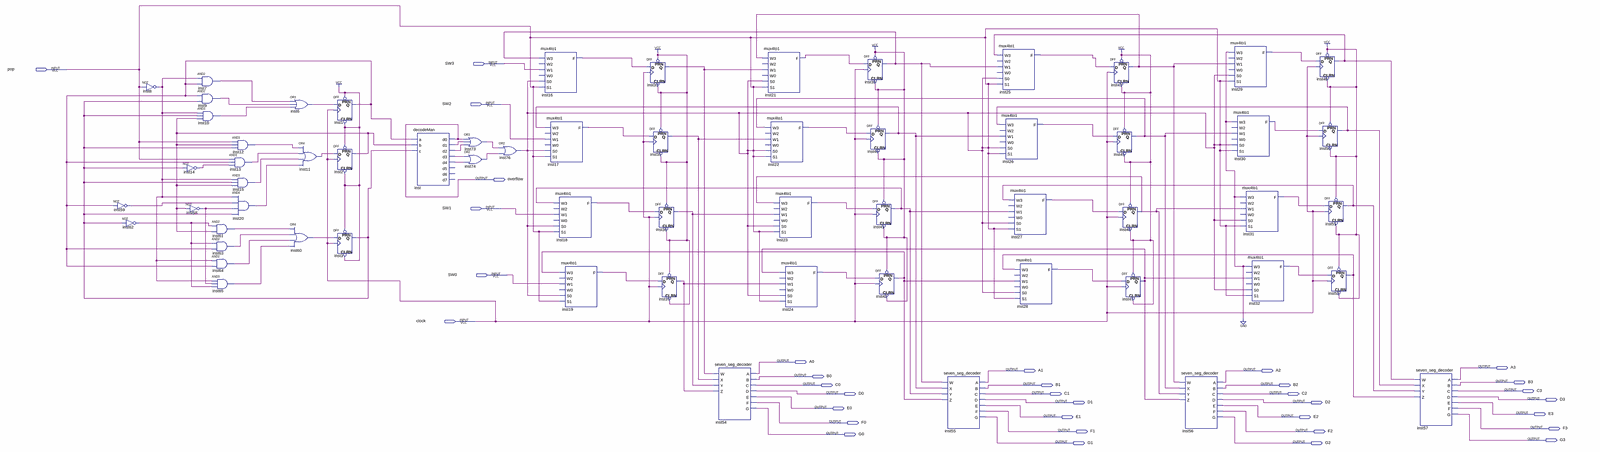
[diagram p0: schematic sheet, whole]
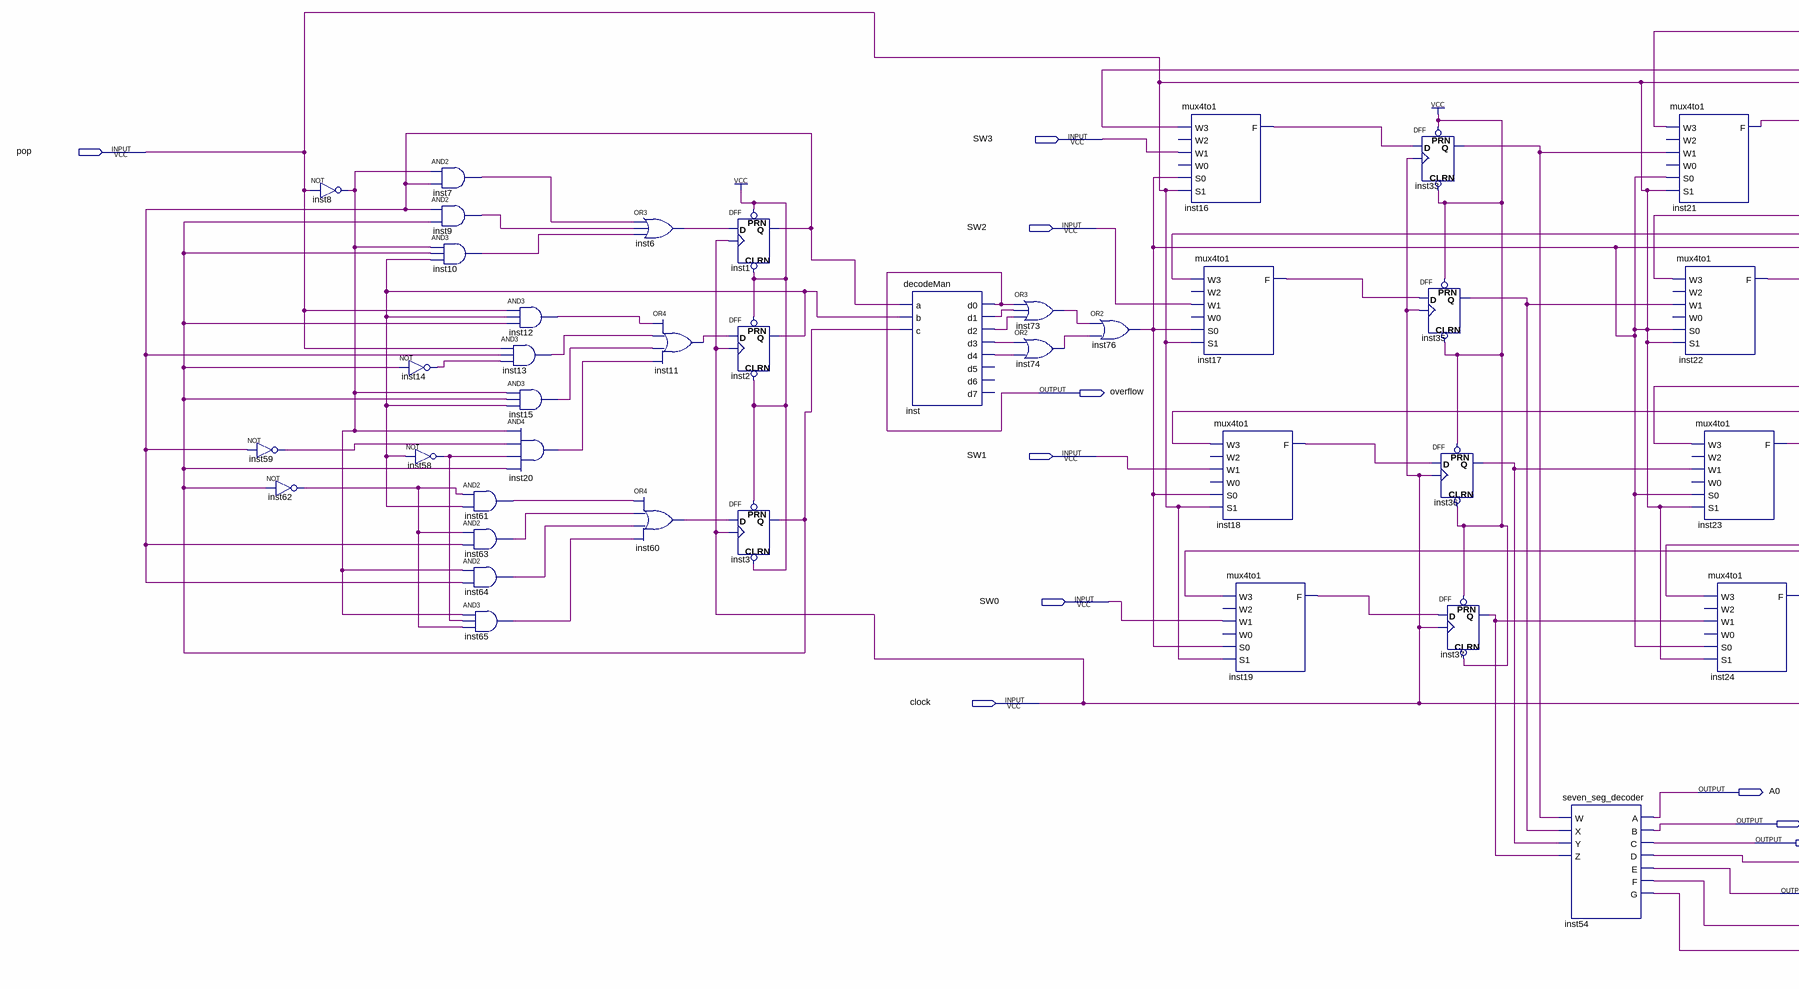
[diagram p1: schematic sheet, left part]
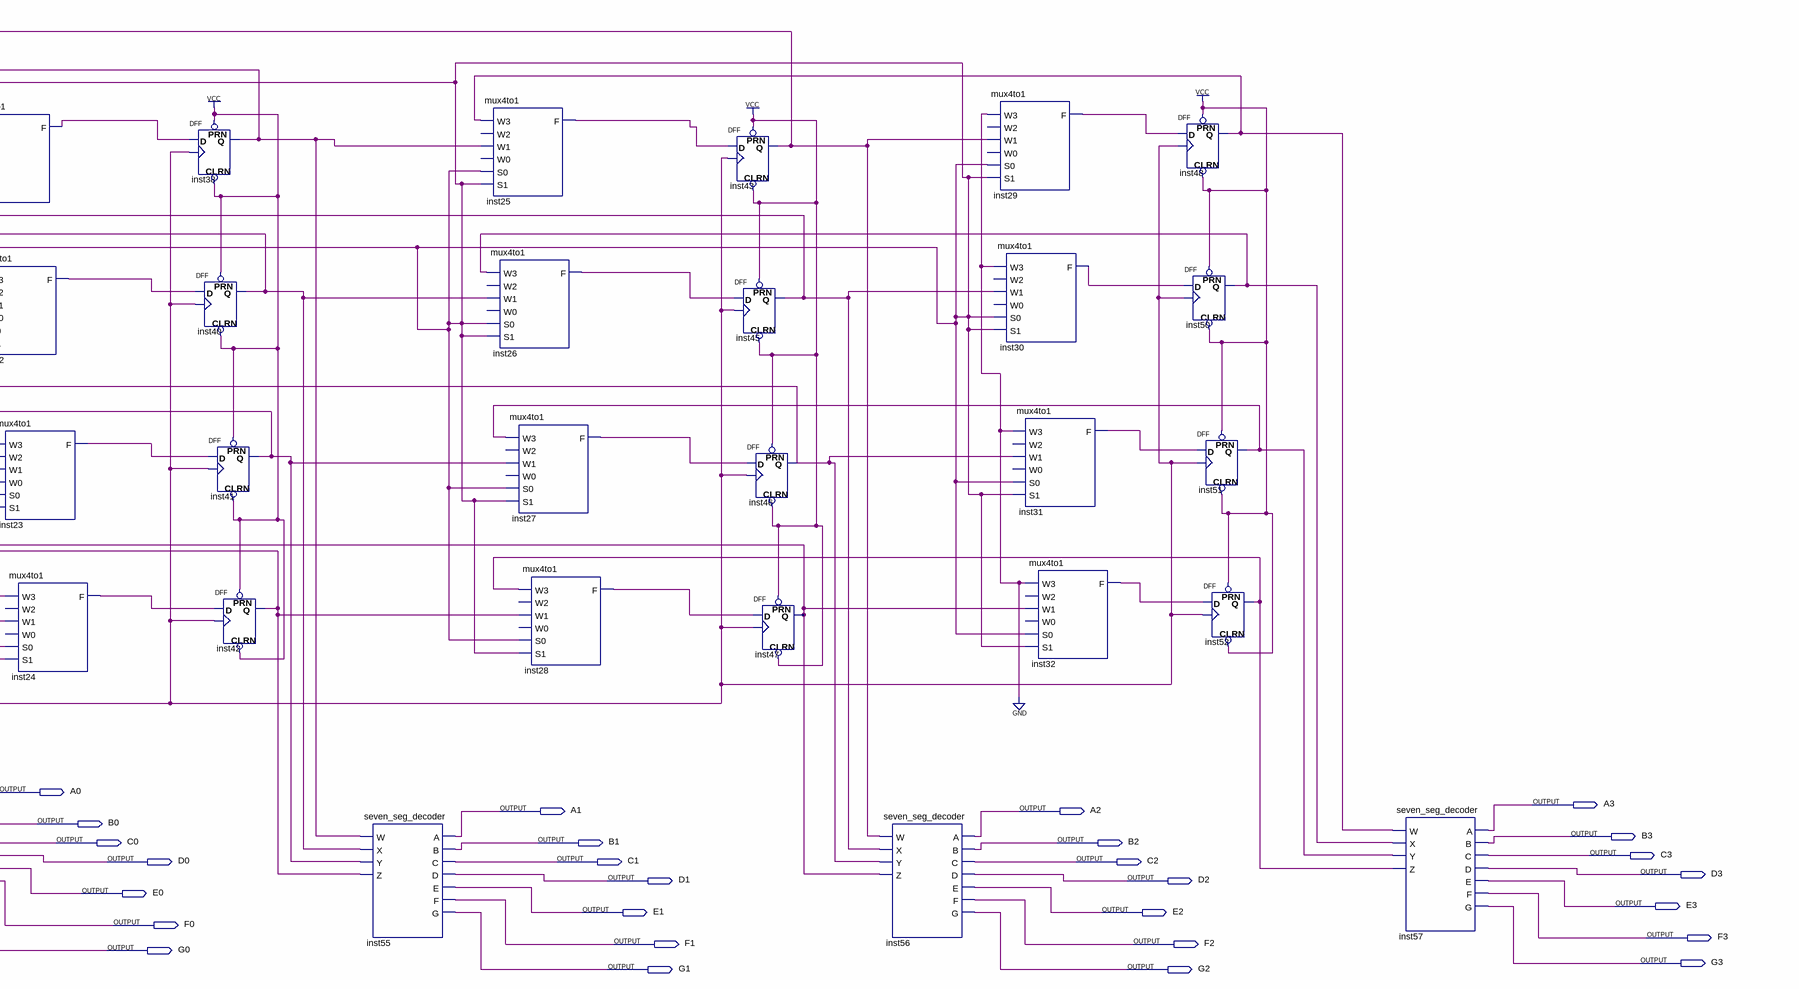
[diagram p2: schematic sheet, right part]
// Quartus schematic AddSubtract.bdf as structural Verilog: 62 symbols, 35 pins
module AddSubtract (
  input  SW3,
  input  pop,
  input  SW2,
  input  SW1,
  input  SW0,
  input  clock,
  output overflow,
  output A0,
  output A3,
  output A1,
  output A2,
  output B0,
  output B3,
  output C0,
  output B1,
  output B2,
  output C3,
  output D0,
  output C1,
  output C2,
  output D3,
  output D1,
  output D2,
  output E0,
  output E3,
  output E1,
  output E2,
  output F0,
  output F3,
  output F1,
  output F2,
  output G0,
  output G3,
  output G1,
  output G2
);

  wire inst1_q, inst2_q, inst3_q, inst6_out, inst7_out, inst8_out, inst9_out, inst10_out, inst11_out,
       inst12_out, inst13_out, inst14_out, inst15_out, inst16_f, inst17_f, inst18_f, inst19_f, inst20_out,
       inst21_f, inst22_f, inst23_f, inst24_f, inst25_f, inst26_f, inst27_f, inst28_f, inst29_f, inst30_f,
       inst31_f, inst32_f, inst33_q, inst35_q, inst36_q, inst37_q, inst38_q, inst40_q, inst41_q, inst42_q,
       inst43_q, inst45_q, inst46_q, inst47_q, inst48_q, inst50_q, inst51_q, inst52_q, inst58_out,
       inst59_out, inst60_out, inst61_out, inst62_out, inst63_out, inst64_out, inst65_out, inst73_out,
       inst74_out, inst_d1, inst_d2, inst_d3, inst_d4;

  not inst59 (inst59_out, inst1_q);
  not inst62 (inst62_out, inst3_q);
  not inst8 (inst8_out, pop);
  not inst14 (inst14_out, inst3_q);
  not inst58 (inst58_out, inst2_q);
  and inst7 (inst7_out, inst8_out, inst1_q);
  and inst9 (inst9_out, inst1_q, inst3_q);
  and inst10 (inst10_out, inst8_out, inst3_q, inst2_q);
  and inst61 (inst61_out, inst62_out, inst2_q);
  and inst63 (inst63_out, inst62_out, inst1_q);
  and inst64 (inst64_out, inst8_out, inst1_q);
  and inst65 (inst65_out, inst8_out, inst58_out, inst62_out);
  and inst12 (inst12_out, pop, inst2_q, inst3_q);
  and inst13 (inst13_out, pop, inst1_q, inst14_out);
  and inst15 (inst15_out, inst8_out, inst3_q, inst2_q);
  and inst20 (inst20_out, inst8_out, inst59_out, inst58_out, inst3_q);
  or inst6 (inst6_out, inst7_out, inst9_out, inst10_out);
  or inst11 (inst11_out, inst12_out, inst13_out, inst15_out, inst20_out);
  or inst60 (inst60_out, inst61_out, inst63_out, inst64_out, inst65_out);
  DFF inst1 (.CLRN(1'b1), .CLK(clock), .D(inst6_out), .PRN(1'b1), .Q(inst1_q));
  DFF inst2 (.CLRN(1'b1), .CLK(clock), .D(inst11_out), .PRN(1'b1), .Q(inst2_q));
  DFF inst3 (.CLRN(1'b1), .CLK(clock), .D(inst60_out), .PRN(1'b1), .Q(inst3_q));
  decodeMan inst (
    .a(inst1_q), .b(inst2_q), .c(inst3_q), .d0(overflow), .d1(inst_d1), .d2(inst_d2), .d3(inst_d3),
    .d4(inst_d4));  // open: d5, d6, d7
  or inst73 (inst73_out, overflow, inst_d1, inst_d2);
  or inst74 (inst74_out, inst_d3, inst_d4);
  or inst76 (pop, inst73_out, inst74_out);
  mux4to1 inst16 (.W3(inst38_q), .W1(SW3), .S0(pop), .S1(pop), .F(inst16_f));  // open: W2, W0
  mux4to1 inst17 (.W3(inst40_q), .W1(SW2), .S0(pop), .S1(pop), .F(inst17_f));  // open: W2, W0
  mux4to1 inst18 (.W3(inst41_q), .W1(SW1), .S0(pop), .S1(pop), .F(inst18_f));  // open: W2, W0
  mux4to1 inst19 (.W3(inst42_q), .W1(SW0), .S0(pop), .S1(pop), .F(inst19_f));  // open: W2, W0
  DFF inst33 (.CLRN(1'b1), .CLK(clock), .D(inst16_f), .PRN(1'b1), .Q(inst33_q));
  DFF inst35 (.CLRN(1'b1), .CLK(clock), .D(inst17_f), .PRN(1'b1), .Q(inst35_q));
  DFF inst36 (.CLRN(1'b1), .CLK(clock), .D(inst18_f), .PRN(1'b1), .Q(inst36_q));
  DFF inst37 (.CLRN(1'b1), .CLK(clock), .D(inst19_f), .PRN(1'b1), .Q(inst37_q));
  seven_seg_decoder inst54 (
    .W(inst33_q), .X(inst35_q), .Y(inst36_q), .Z(inst37_q), .A(A0), .B(B0), .C(C0), .D(D0), .E(E0), .F(F0),
    .G(G0));
  mux4to1 inst21 (.W3(inst43_q), .W1(inst33_q), .S0(pop), .S1(pop), .F(inst21_f));  // open: W2, W0
  mux4to1 inst22 (.W3(inst45_q), .W1(inst35_q), .S0(pop), .S1(pop), .F(inst22_f));  // open: W2, W0
  mux4to1 inst23 (.W3(inst46_q), .W1(inst36_q), .S0(pop), .S1(pop), .F(inst23_f));  // open: W2, W0
  mux4to1 inst24 (.W3(inst47_q), .W1(inst37_q), .S0(pop), .S1(pop), .F(inst24_f));  // open: W2, W0
  DFF inst38 (.CLRN(1'b1), .CLK(clock), .D(inst21_f), .PRN(1'b1), .Q(inst38_q));
  DFF inst40 (.CLRN(1'b1), .CLK(clock), .D(inst22_f), .PRN(1'b1), .Q(inst40_q));
  DFF inst41 (.CLRN(1'b1), .CLK(clock), .D(inst23_f), .PRN(1'b1), .Q(inst41_q));
  DFF inst42 (.CLRN(1'b1), .CLK(clock), .D(inst24_f), .PRN(1'b1), .Q(inst42_q));
  seven_seg_decoder inst55 (
    .W(inst38_q), .X(inst40_q), .Y(inst41_q), .Z(inst42_q), .A(A1), .B(B1), .C(C1), .D(D1), .E(E1), .F(F1),
    .G(G1));
  mux4to1 inst25 (.W3(inst48_q), .W1(inst38_q), .S0(pop), .S1(pop), .F(inst25_f));  // open: W2, W0
  mux4to1 inst26 (.W3(inst50_q), .W1(inst40_q), .S0(pop), .S1(pop), .F(inst26_f));  // open: W2, W0
  mux4to1 inst27 (.W3(inst51_q), .W1(inst41_q), .S0(pop), .S1(pop), .F(inst27_f));  // open: W2, W0
  mux4to1 inst28 (.W3(inst52_q), .W1(inst42_q), .S0(pop), .S1(pop), .F(inst28_f));  // open: W2, W0
  DFF inst43 (.CLRN(1'b1), .CLK(clock), .D(inst25_f), .PRN(1'b1), .Q(inst43_q));
  DFF inst45 (.CLRN(1'b1), .CLK(clock), .D(inst26_f), .PRN(1'b1), .Q(inst45_q));
  DFF inst46 (.CLRN(1'b1), .CLK(clock), .D(inst27_f), .PRN(1'b1), .Q(inst46_q));
  DFF inst47 (.CLRN(1'b1), .CLK(clock), .D(inst28_f), .PRN(1'b1), .Q(inst47_q));
  seven_seg_decoder inst56 (
    .W(inst43_q), .X(inst45_q), .Y(inst46_q), .Z(inst47_q), .A(A2), .B(B2), .C(C2), .D(D2), .E(E2), .F(F2),
    .G(G2));
  mux4to1 inst29 (.W3(1'b0), .W1(inst43_q), .S0(pop), .S1(pop), .F(inst29_f));  // open: W2, W0
  mux4to1 inst30 (.W3(1'b0), .W1(inst45_q), .S0(pop), .S1(pop), .F(inst30_f));  // open: W2, W0
  mux4to1 inst31 (.W3(1'b0), .W1(inst46_q), .S0(pop), .S1(pop), .F(inst31_f));  // open: W2, W0
  mux4to1 inst32 (.W3(1'b0), .W1(inst47_q), .S0(pop), .S1(pop), .F(inst32_f));  // open: W2, W0
  DFF inst48 (.CLRN(1'b1), .CLK(clock), .D(inst29_f), .PRN(1'b1), .Q(inst48_q));
  DFF inst50 (.CLRN(1'b1), .CLK(clock), .D(inst30_f), .PRN(1'b1), .Q(inst50_q));
  DFF inst51 (.CLRN(1'b1), .CLK(clock), .D(inst31_f), .PRN(1'b1), .Q(inst51_q));
  DFF inst52 (.CLRN(1'b1), .CLK(clock), .D(inst32_f), .PRN(1'b1), .Q(inst52_q));
  seven_seg_decoder inst57 (
    .W(inst48_q), .X(inst50_q), .Y(inst51_q), .Z(inst52_q), .A(A3), .B(B3), .C(C3), .D(D3), .E(E3), .F(F3),
    .G(G3));
endmodule
